# Altium project imx8mnano_som.PrjPcb
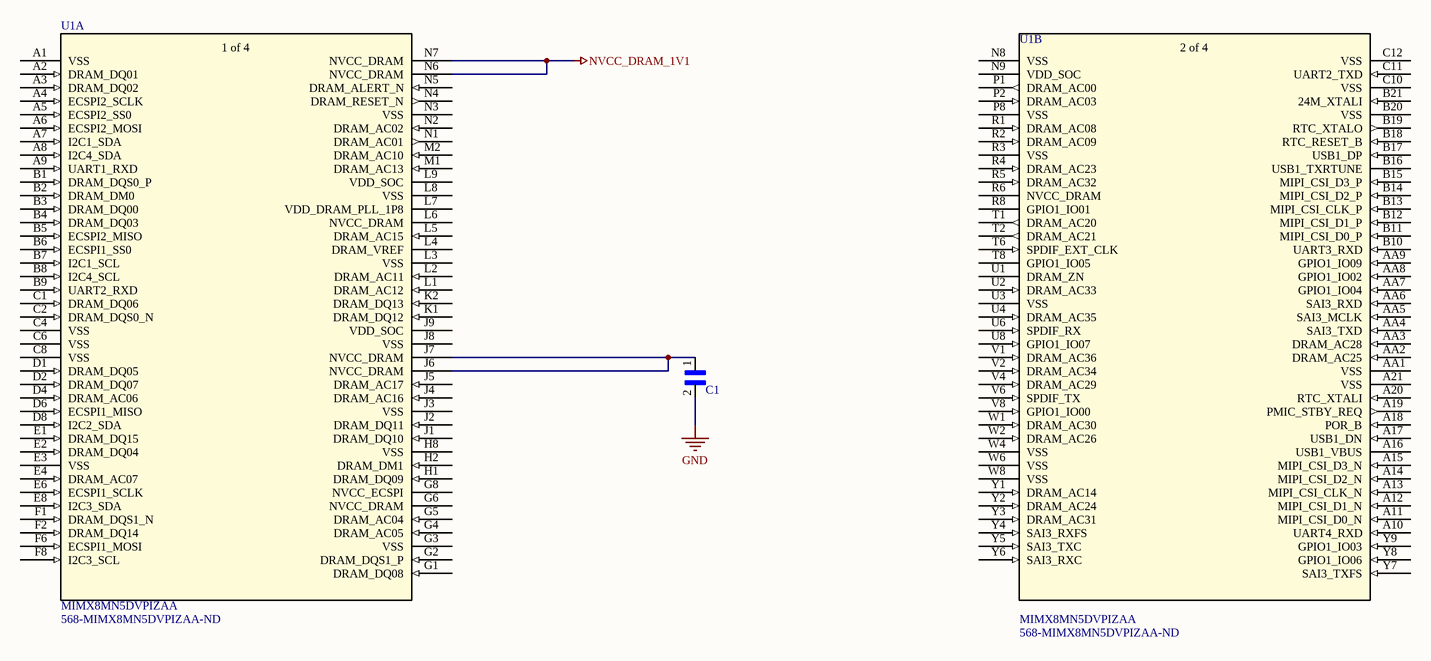
[diagram p0: imx8mnano_power.SchDoc]
7 sheets, 38 parts. Net scope: global (net labels, ports and power ports of the same name join across sheets).
Board file: imx8mnano.PcbDoc
Sheets:
  01_block_digram.SchDoc
  imx8mnano_power.SchDoc
  LPDDR4.SchDoc
  USB.SchDoc
  PMIC.SchDoc
  eMMC_QSPI.SchDoc
  imx8mnano_B.SchDoc

## Sheet 01_block_digram.SchDoc
size A; SheetNumber: 1; SheetTotal: 1

## Sheet imx8mnano_power.SchDoc
size A3; SheetNumber: 2; SheetTotal: 6

### Parts
C1  CL05A106MQ5NUNC  [CL05A106MQ5NUNC]  (value not drawn)
U1  MIMX8MN5DVPIZAA  Supplier Part Number 1: 568-MIMX8MN5DVPIZAA-ND  [MIMX8MN5DVPIZAA_NXP]  (parts A,B of 4)

### Nets
GND: C1.2
NVCC_DRAM_1V1: U1.N6(NVCC_DRAM) U1.N7(NVCC_DRAM)
NetC1_1: C1.1 U1.J6(NVCC_DRAM) U1.J7(NVCC_DRAM)

Not connected (* = marked no-connect by the designer): U1 A1(VSS) A2(DRAM_DQ01) A3(DRAM_DQ02) A4(ECSPI2_SCLK) A5(ECSPI2_SS0) A6(ECSPI2_MOSI) A7(I2C1_SDA) A8(I2C4_SDA) A9(UART1_RXD) A10(UART4_RXD) A11(MIPI_CSI_D0_N) A12(MIPI_CSI_D1_N) A13(MIPI_CSI_CLK_N) A14(MIPI_CSI_D2_N) A15(MIPI_CSI_D3_N) A16(USB1_VBUS) A17(USB1_DN) A18(POR_B) A19(PMIC_STBY_REQ) A20(RTC_XTALI) A21(VSS) AA1(VSS) AA2(DRAM_AC25) AA3(DRAM_AC28) AA4(SAI3_TXD) AA5(SAI3_MCLK) AA6(SAI3_RXD) AA7(GPIO1_IO04) AA8(GPIO1_IO02) AA9(GPIO1_IO09) B1(DRAM_DQS0_P) B2(DRAM_DM0) B3(DRAM_DQ00) B4(DRAM_DQ03) B5(ECSPI2_MISO) B6(ECSPI1_SS0) B7(I2C1_SCL) B8(I2C4_SCL) B9(UART2_RXD) B10(UART3_RXD) B11(MIPI_CSI_D0_P) B12(MIPI_CSI_D1_P) B13(MIPI_CSI_CLK_P) B14(MIPI_CSI_D2_P) B15(MIPI_CSI_D3_P) B16(USB1_TXRTUNE) B17(USB1_DP) B18(RTC_RESET_B) B19(RTC_XTALO) B20(VSS) B21(24M_XTALI) C1(DRAM_DQ06) C2(DRAM_DQS0_N) C4(VSS) C6(VSS) C8(VSS) C10(VSS) C11(UART2_TXD) C12(VSS) D1(DRAM_DQ05) D2(DRAM_DQ07) D4(DRAM_AC06) D6(ECSPI1_MISO) D8(I2C2_SDA) E1(DRAM_DQ15) E2(DRAM_DQ04) E3(VSS) E4(DRAM_AC07) E6(ECSPI1_SCLK) E8(I2C3_SDA) F1(DRAM_DQS1_N) F2(DRAM_DQ14) F6(ECSPI1_MOSI) F8(I2C3_SCL) G1(DRAM_DQ08) G2(DRAM_DQS1_P) G3(VSS) G4(DRAM_AC05) G5(DRAM_AC04) G6(NVCC_DRAM) G8(NVCC_ECSPI) H1(DRAM_DQ09) H2(DRAM_DM1) H8(VSS) J1(DRAM_DQ10) J2(DRAM_DQ11) J3(VSS) J4(DRAM_AC16) J5(DRAM_AC17) J8(VSS) J9(VDD_SOC) K1(DRAM_DQ12) K2(DRAM_DQ13) L1(DRAM_AC12) L2(DRAM_AC11) L3(VSS) L4(DRAM_VREF) L5(DRAM_AC15) L6(NVCC_DRAM) L7(VDD_DRAM_PLL_1P8) L8(VSS) L9(VDD_SOC) M1(DRAM_AC13) M2(DRAM_AC10) N1(DRAM_AC01) N2(DRAM_AC02) N3(VSS) N4(DRAM_RESET_N) N5(DRAM_ALERT_N) N8(VSS) N9(VDD_SOC) P1(DRAM_AC00) P2(DRAM_AC03) P8(VSS) R1(DRAM_AC08) R2(DRAM_AC09) R3(VSS) R4(DRAM_AC23) R5(DRAM_AC32) R6(NVCC_DRAM) R8(GPIO1_IO01) T1(DRAM_AC20) T2(DRAM_AC21) T6(SPDIF_EXT_CLK) T8(GPIO1_IO05) U1(DRAM_ZN) U2(DRAM_AC33) U3(VSS) U4(DRAM_AC35) U6(SPDIF_RX) U8(GPIO1_IO07) V1(DRAM_AC36) V2(DRAM_AC34) V4(DRAM_AC29) V6(SPDIF_TX) V8(GPIO1_IO00) W1(DRAM_AC30) W2(DRAM_AC26) W4(VSS) W6(VSS) W8(VSS) Y1(DRAM_AC14) Y2(DRAM_AC24) Y3(DRAM_AC31) Y4(SAI3_RXFS) Y5(SAI3_TXC) Y6(SAI3_RXC) Y7(SAI3_TXFS) Y8(GPIO1_IO06) Y9(GPIO1_IO03)

### Notes on the sheet
- (in symbol MIMX8MN5DVPIZAA, part A) 1 of 4
- (in symbol MIMX8MN5DVPIZAA, part B) 2 of 4

### Library data of the parts
C1 = CL05A106MQ5NUNC: Multilayer Ceramic Capacitor, 10 uF, 6.3 V, ï¿½ 20%, X5R, 0402 [1005 Metric]; Manufacturer: Samsung; Capacitance: 10uF; Voltage Rating: 6.3V; Supplier 1: Avnet; Manufacturer Part Number: CL05A106MQ5NUNC; RoHS: Yes; Category: Ceramic Capacitors; Stock 1: 540000; Pricing 1: 10000=0.02499, 20000=0.02486, 40000=0.02474, 60000=0.02461, 80000=0.02448 (USD); Mount: Surface Mount; Case/Package: 0402; Case Code (Metric): 1005; Case Code (Imperial): 0402; Min Operating Temperature: -55°C; Max Operating Temperature: 85°C; Packaging: Tape and Reel; Tolerance: 20%; Package Quantity: 1; Dielectric: X5R; Series: CL; Construction: Flat; Length: 1mm; Width: 0.02inch; Height: 0.5mm; Thickness: 0.028inch; Depth: 0.5mm; Radiation Hardening: No; RoHS Compliant: Yes; ComponentLink1URL: https://datasheet.ciiva.com/16437/cl05a106mq5nunc-16437356.pdf?src-supplier=Future+Electronics; ComponentLink1Description: https://datasheet.ciiva.com/16437/cl05a106mq5nunc-16437356.pdf?src-supplier=Future+Electronics; ComponentLink2URL: https://datasheet.ciiva.com/26877/getdatasheetpartid-355289-26877841.pdf?src-supplier=Verical; ComponentLink2Description: https://datasheet.ciiva.com/26877/getdatasheetpartid-355289-26877841.pdf?src-supplier=Verical; Supplier Part Number 1: CL05A106MQ5NUNC
U1 = MIMX8MN5DVPIZAA: I.mx 8M Nano Ultralite, Tray Multiple Dp Bakeable, Tray Rohs Compliant: Yes; Manufacturer: NXP Semiconductors; Supplier 1: Digikey; Manufacturer Part Number: MIMX8MN5DVPIZAA; RoHS: Yes; Category: Microprocessors; Stock 1: 138; Pricing 1: 1=24.94, 10=20.041, 25=18.818, 168=17.09119, 336=16.65952, 504=16.44345 (USD)

## Sheet LPDDR4.SchDoc
size A3; SheetNumber: 3; SheetTotal: 3
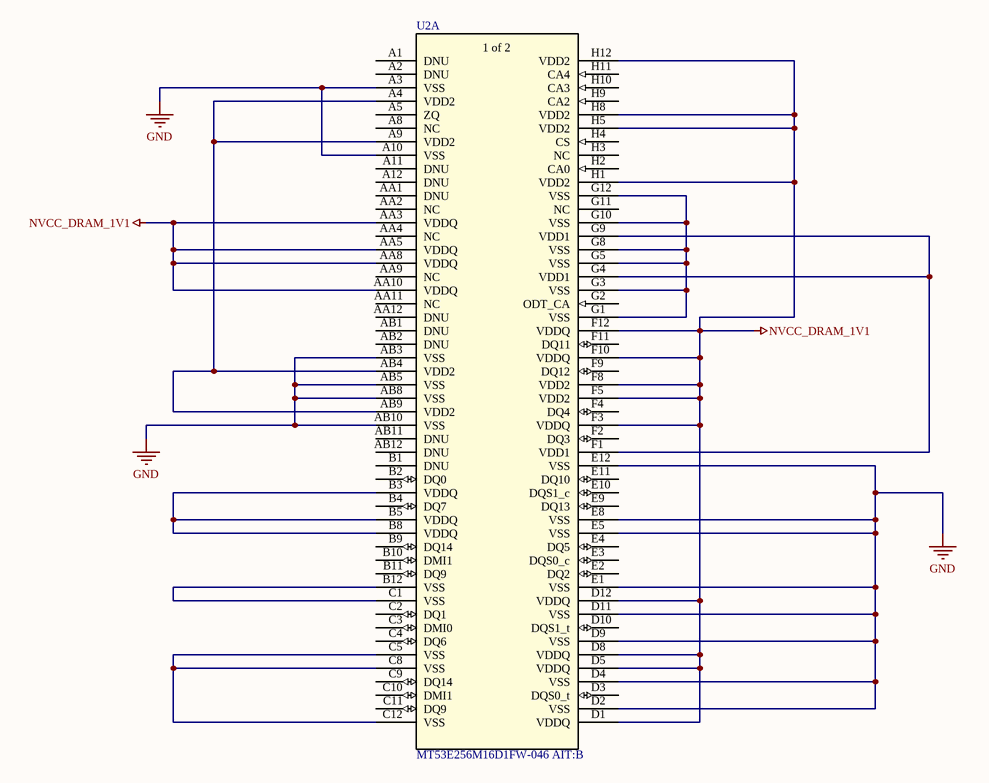
[diagram p1: LPDDR4.SchDoc]

### Parts
U2  MT53E256M16D1FW-046 AIT:B  [TFBGA200_10X14p5X1p1_FW_MRN-M]  (part A of 2)

### Nets
GND: U2.A3(VSS) U2.A10(VSS) U2.AB3(VSS) U2.AB5(VSS) U2.AB8(VSS) U2.AB10(VSS) U2.D2(VSS) U2.D4(VSS) U2.D9(VSS) U2.D11(VSS) U2.E1(VSS) U2.E5(VSS) U2.E8(VSS) U2.E12(VSS)
NVCC_DRAM_1V1: U2.AA3(VDDQ) U2.AA5(VDDQ) U2.AA8(VDDQ) U2.AA10(VDDQ) U2.D1(VDDQ) U2.D5(VDDQ) U2.D8(VDDQ) U2.D12(VDDQ) U2.F3(VDDQ) U2.F5(VDD2) U2.F8(VDD2) U2.F10(VDDQ) U2.F12(VDDQ) U2.H1(VDD2) U2.H5(VDD2) U2.H8(VDD2) U2.H12(VDD2)
NetU2_A4: U2.A4(VDD2) U2.A9(VDD2) U2.AB4(VDD2) U2.AB9(VDD2)
NetU2_B3: U2.B3(VDDQ) U2.B5(VDDQ) U2.B8(VDDQ)
NetU2_B12: U2.B12(VSS) U2.C1(VSS)
NetU2_C5: U2.C5(VSS) U2.C8(VSS) U2.C12(VSS)
NetU2_F1: U2.F1(VDD1) U2.G4(VDD1) U2.G9(VDD1)
NetU2_G1: U2.G1(VSS) U2.G3(VSS) U2.G5(VSS) U2.G8(VSS) U2.G10(VSS) U2.G12(VSS)

Not connected (* = marked no-connect by the designer): U2 A1(DNU) A2(DNU) A5(ZQ) A8(NC) A11(DNU) A12(DNU) AA1(DNU) AA2(NC) AA4(NC) AA9(NC) AA11(NC) AA12(DNU) AB1(DNU) AB2(DNU) AB11(DNU) AB12(DNU) B1(DNU) B2(DQ0) B4(DQ7) B9(DQ14) B10(DMI1) B11(DQ9) C2(DQ1) C3(DMI0) C4(DQ6) C9(DQ14) C10(DMI1) C11(DQ9) D3(DQS0_t) D10(DQS1_t) E2(DQ2) E3(DQS0_c) E4(DQ5) E9(DQ13) E10(DQS1_c) E11(DQ10) F2(DQ3) F4(DQ4) F9(DQ12) F11(DQ11) G2(ODT_CA) G11(NC) H2(CA0) H3(NC) H4(CS) H9(CA2) H10(CA3) H11(CA4)

### Notes on the sheet
- (in symbol MT53E256M16D1FW-046 AIT:B, part A) 1 of 2

### Library data of the parts
U2 = MT53E256M16D1FW-046 AIT:B: No Description Available; Mfr_Name: Micron; Type: Memory; RefDes: RefDes

## Sheet USB.SchDoc
size A; SheetNumber: 4; SheetTotal: 5
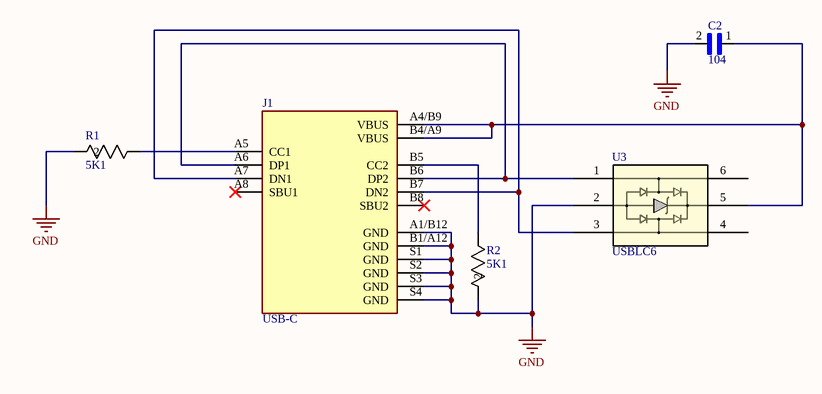
[diagram p2: USB.SchDoc]

### Parts
C2  104  [CAPC1005X55N2]
J1  USB-C  [GCT_USB4110GFA]
R1  5K1  [RC0402]
R2  5K1  [RC0402]
U3  USBLC6  [SOT23-6L_STM]

### Nets
GND: C2.2 J1.A1/B12(GND) J1.B1/A12(GND) J1.S1(GND) J1.S2(GND) J1.S3(GND) J1.S4(GND) R1.2 R2.2 U3.2
NetC2_1: C2.1 J1.A4/B9(VBUS) J1.B4/A9(VBUS) U3.5
NetJ1_A5: J1.A5(CC1) R1.1
NetJ1_A6: J1.A6(DP1) J1.B6(DP2) U3.1
NetJ1_A7: J1.A7(DN1) J1.B7(DN2) U3.3
NetJ1_B5: J1.B5(CC2) R2.1

Not connected (* = marked no-connect by the designer): J1 A8(SBU1)* B8(SBU2)*; U3 4 6

### Library data of the parts
C2 = CC0402KRX7R7BB104: Multilayer Ceramic Capacitor, 0.1 uF, 16 V, ï¿½ 10%, X7R, 0402 [1005 Metric]; Manufacturer: Yageo; Material: 4241ConductorMaterial; Capacitance: 100nF; Voltage Rating: 16V; Temperature Coefficient: 30ppm/°C; Supplier 1: Digikey; Manufacturer Part Number: CC0402KRX7R7BB104; RoHS: Yes; Category: Ceramic Capacitors; Stock 1: 15609894; Pricing 1: 1=0.1, 10=0.024, 50=0.0164, 100=0.0139, 500=0.0098, 1000=0.00852, 2500=0.00718, 5000=0.00636 (USD); Mount: Surface Mount; Case/Package: 0402; Number of Pins: 2; Case Code (Metric): 1005; Case Code (Imperial): 0402; Min Operating Temperature: -55°C; Max Operating Temperature: 125°C; Tolerance: 10%; Voltage Rating (DC): 16V; Packaging: Tape and Reel; Package Quantity: 1; Dielectric: X7R; Termination: SMD/SMT; Voltage: 16V; Series: CC; Voltage Rating (AC): 16V; Length: 1mm; Width: 0.02inch; Height: 0.5mm; Thickness: 0.022inch; Depth: 0.5mm; Radiation Hardening: No; Reach SVHC Compliant: No; RoHS Compliant: Yes; Halogen Free: 5694HalogenFree; Lead Free: 5697LeadFree; ComponentLink1URL: https://datasheet.ciiva.com/11788/0900766b80ce67ed-11788364.pdf?src-supplier=Rs; ComponentLink1Description: https://datasheet.ciiva.com/11788/0900766b80ce67ed-11788364.pdf?src-supplier=Rs; ComponentLink2URL: https://datasheet.ciiva.com/7978/1489800-7978111.pdf?src-supplier=Element14; ComponentLink2Description: https://datasheet.ciiva.com/7978/1489800-7978111.pdf?src-supplier=Element14; ComponentLink3URL: https://datasheet.ciiva.com/161/mlccorderingcode-161545.pdf?src-supplier=Digikey; ComponentLink3Description: https://datasheet.ciiva.com/161/mlccorderingcode-161545.pdf?src-supplier=Digikey; ComponentLink4URL: https://datasheet.ciiva.com/161/mlccorderingcode-161544.pdf?src-supplier=Digikey; ComponentLink4Description: https://datasheet.ciiva.com/161/mlccorderingcode-161544.pdf?src-supplier=Digikey; ComponentLink5URL: https://datasheet.ciiva.com/161/mlccorderingcode-161546.pdf?src-supplier=Digikey; ComponentLink5Description: https://datasheet.ciiva.com/161/mlccorderingcode-161546.pdf?src-supplier=Digikey; ComponentLink6URL: https://datasheet.ciiva.com/8033/1734573-8033661.pdf?src-supplier=Element14; ComponentLink6Description: https://datasheet.ciiva.com/8033/1734573-8033661.pdf?src-supplier=Element14; ComponentLink7URL: https://datasheet.ciiva.com/11587/upy-gphc-x7r-6-3v-to-50v-8-11587305.pdf?src-supplier=Avnet; ComponentLink7Description: https://datasheet.ciiva.com/11587/upy-gphc-x7r-6-3v-to-50v-8-11587305.pdf?src-supplier=Avnet; LCSC: C60474; Supplier Part Number 1: 311-1338-1-ND
J1 = USB4110-GF-A: USB Connector, 16 Contact(s), Male, Right Angle, Surface Mount Terminal, Locking, Receptacle; Manufacturer: Global Connector Technology; USB Standard: 6108USBStandard; Number of Contacts: 16NUMBER; Voltage Rating: 20V; Supplier 1: Digikey; Manufacturer Part Number: USB4110-GF-A; RoHS: No; Category: USB Connectors; Stock 1: 30215; Pricing 1: 1=1.64, 10=1.244, 25=1.1176, 50=1.032, 100=0.9547, 250=0.86368, 500=0.80254 (USD); Number of Pins: 16NUMBER; Contact Material: 153,157ConductorMaterial; Orientation: 5496OrientationType; Height: 3.46mm; ComponentLink1URL: https://gct.co/files/drawings/usb4110.pdf?src-supplier=Digikey; ComponentLink1Description: https://gct.co/files/drawings/usb4110.pdf?src-supplier=Digikey; Supplier Part Number 1: 2073-USB4110-GF-A-1-ND; LCSC: USB4110-GF-A
R1 R2 = RC0402FR-075K1L: SMD Chip Resistor, 5.1 kOhm, ï¿½ 1%, 62.5 mW, 0402 [1005 Metric], Thick Film, General Purpose; Manufacturer: Yageo; Power Rating: 63mW; Voltage Rating: 50V; Resistance: 5.1kR; Temperature Coefficient: 100ppm/°C; Supplier 1: Digikey; Manufacturer Part Number: RC0402FR-075K1L; RoHS: Yes; Category: Chip SMD Resistors; Stock 1: 868211; Pricing 1: 1=0.1, 10=0.009, 50=0.0072, 100=0.0041, 500=0.00306 (USD); Case/Package: 0402; Case Code (Metric): 1005; Case Code (Imperial): 0402; Min Operating Temperature: -55°C; Max Operating Temperature: 155°C; Tolerance: 1%; Packaging: Tape and Reel; Package Quantity: 1; Resistor Type: Thick Film; Number of Terminations: 2; Termination: SMD/SMT; Max Power Dissipation: 63mW; Features: Moisture Resistant; Series: RC; Resistance Tolerance: 1%; Technology: THICK FILM; Voltage Rating (DC): 50V; Working Voltage: 50V; Construction: Rectangular; Length: 1mm; Width: 0.02inch; Height: 0.016inch; Depth: 0.5mm; RoHS Compliant: Yes; Reach SVHC Compliant: Unknown; Lead Free: 5697LeadFree; Military Standard: Not; Supplier Part Number 1: 311-5.10KLRCT-ND; LCSC: C105872
U3 = USBLC6-2SC6: ESD Suppressor Diode Array Dual Uni-Dir 15kV Air Gap/15kV Contact Disc 6-Pin SOT-23 T/R; Manufacturer: STMicroelectronics; Data Rate: 480Mbps; Direction: Unidirectional,Bidirectional; Capacitance: 3.5pF; Operating Supply Voltage: 1.1V; Number of Elements: 1; Number of Channels: 2; Reverse Breakdown Voltage: 6V; Clamping Voltage: 17V; Working Voltage: 5V; Reverse Standoff Voltage: 5.25V; Power Line Protection: Yes; Test Current: 1mA; Max Reverse Leakage Current: 150nA; Peak Pulse Current: 5A; Supplier 1: Digikey; Manufacturer Part Number: USBLC6-2SC6; RoHS: Yes; Category: TVS Diodes; Stock 1: 85420; Pricing 1: 1=0.36, 10=0.243, 100=0.163, 500=0.127, 1000=0.114, 3000=0.09, 6000=0.084, 9000=0.078, 15000=0.077, 21000=0.0755, 30000=0.075 (USD); Mount: Surface Mount; Case/Package: SOT-23; Number of Pins: 6; Min Operating Temperature: -40°C; Max Operating Temperature: 125°C; Packaging: Tape and Reel; Package Quantity: 3000; Polarity: Unidirectional,Bidirectional; Breakdown Voltage: 6V; Termination: SMD/SMT; Number of Bidirectional Channels: 2; Min Breakdown Voltage: 6V; ESD Protection: Yes; Max Breakdown Voltage: 6V; Leakage Current: 150nA; Series: USB; Clamping Voltage-Max: 17V; Max Repetitive Reverse Voltage (Vrrm): 5.25V; Length: 3.05mm; Width: 1.75mm; Height: 1.3mm; Depth: 1.75mm; Radiation Hardening: No; Reach SVHC Compliant: No; Lead Free: Lead Free; RoHS Compliant: Yes; ComponentLink1URL: https://datasheet.ciiva.com/1268/1690354-1268384.pdf?src-supplier=Element14; ComponentLink1Description: https://datasheet.ciiva.com/1268/1690354-1268384.pdf?src-supplier=Element14; ComponentLink2URL: https://datasheet.ciiva.com/4508/cd00050750-113117-4508433.pdf?src-supplier=Mouser; ComponentLink2Description: https://datasheet.ciiva.com/4508/cd00050750-113117-4508433.pdf?src-supplier=Mouser; ComponentLink3URL: https://datasheet.ciiva.com/41444/001184109-da-01-en-ic-esd-protecti-usblc6-2sc6-sot-23-6-stm-41444156.pdf?src-supplier=Conrad; ComponentLink3Description: https://datasheet.ciiva.com/41444/001184109-da-01-en-ic-esd-protecti-usblc6-2sc6-sot-23-6-stm-41444156.pdf?src-supplier=Conrad; Supplier Part Number 1: 497-5235-1-ND; LCSC: C5250994

## Sheet PMIC.SchDoc
size A3; SheetNumber: 5; SheetTotal: 5
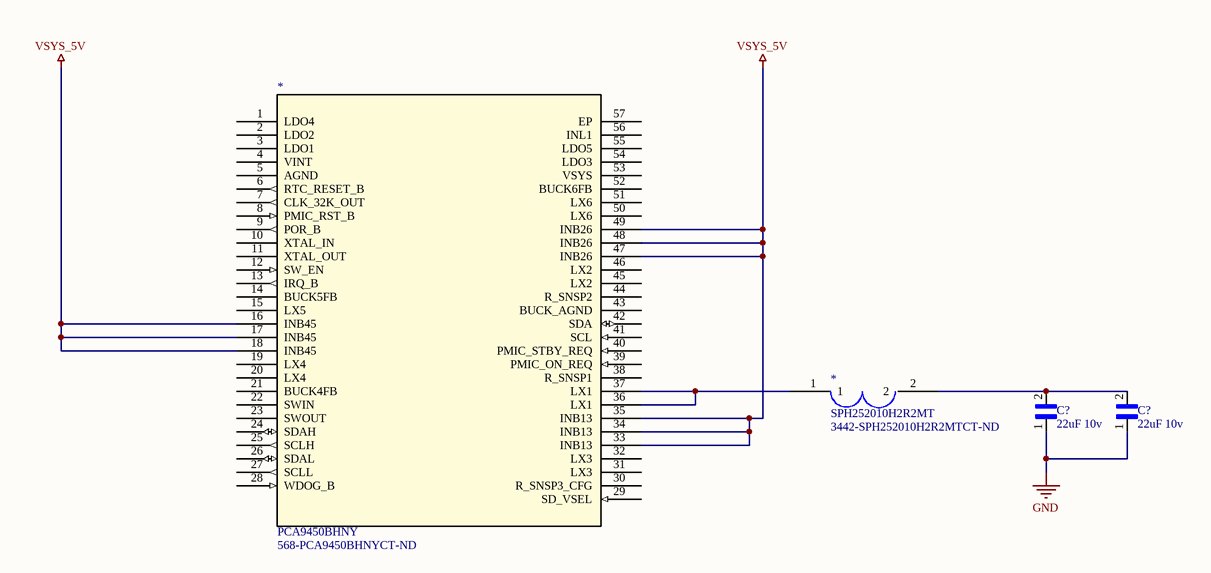
[diagram p3: PMIC.SchDoc]

### Parts
(Parts that share a designator on the sheet are numbered #1, #2 ... from top to bottom, then left to right.)
*#1  PCA9450BHNY  Supplier Part Number 1: 568-PCA9450BHNYCT-ND  [HVQFN56_SOT949-6_NXP]
*#2  SPH252010H2R2MT  Supplier Part Number 1: 3442-SPH252010H2R2MTCT-ND  [IND-SMD_L2.5-W2.0_SWPA252012S]
C?#1  22uF 10v  [CAPC1608X100N]
C?#2  22uF 10v  [CAPC1608X100N]

### Nets
GND: C?#1.1 C?#2.1
VSYS_5V: *#1.16(INB45) *#1.17(INB45) *#1.18(INB45) *#1.33(INB13) *#1.34(INB13) *#1.35(INB13) *#1.47(INB26) *#1.48(INB26) *#1.49(INB26)
Net*#1_36: *#1.36(LX1) *#1.37(LX1) *#2.1
Net*#2_2: *#2.2 C?#1.2 C?#2.2

Not connected (* = marked no-connect by the designer): *#1 1(LDO4) 2(LDO2) 3(LDO1) 4(VINT) 5(AGND) 6(RTC_RESET_B) 7(CLK_32K_OUT) 8(PMIC_RST_B) 9(POR_B) 10(XTAL_IN) 11(XTAL_OUT) 12(SW_EN) 13(IRQ_B) 14(BUCK5FB) 15(LX5) 19(LX4) 20(LX4) 21(BUCK4FB) 22(SWIN) 23(SWOUT) 24(SDAH) 25(SCLH) 26(SDAL) 27(SCLL) 28(WDOG_B) 29(SD_VSEL) 30(R_SNSP3_CFG) 31(LX3) 32(LX3) 38(R_SNSP1) 39(PMIC_ON_REQ) 40(PMIC_STBY_REQ) 41(SCL) 42(SDA) 43(BUCK_AGND) 44(R_SNSP2) 45(LX2) 46(LX2) 50(LX6) 51(LX6) 52(BUCK6FB) 53(VSYS) 54(LDO3) 55(LDO5) 56(INL1) 57(EP)

### Library data of the parts
*#1 = PCA9450BHNY: Power Manage Ic (Pmic) For I.mx 8M Nano Rohs Compliant: Yes |Nxp PCA9450BHNY; Manufacturer: NXP Semiconductors; Supplier 1: Digikey; Manufacturer Part Number: PCA9450BHNY; RoHS: No; Category: Power Management ICs; Stock 1: 7995; Pricing 1: 1=5.66, 10=4.331, 25=3.9992, 100=3.6339, 250=3.45972, 500=3.35474, 1000=3.26833 (USD); RoHS Compliant: Yes; ComponentLink1URL: https://datasheet.octopart.com/PCA9450BHNY-NXP-Semiconductors-datasheet-150009921.pdf?src-supplier=Future+Electronics; ComponentLink1Description: https://datasheet.octopart.com/PCA9450BHNY-NXP-Semiconductors-datasheet-150009921.pdf?src-supplier=Future+Electronics
*#2 = SPH252010H2R2MT: Fixed Ind 2.220%UH 0.114 Ohm 1800; Manufacturer: Sunlord; Supplier 1: Digikey; Manufacturer Part Number: SPH252010H2R2MT; RoHS: Yes; Category: Fixed Inductors; Stock 1: 1953; Pricing 1: 1=0.27, 10=0.207, 25=0.1872, 50=0.1736, 100=0.1609, 250=0.14548, 500=0.13478, 1000=0.125 (USD); RoHS Compliant: Yes
C?#1 C?#2 = GRM188R61A226ME15D: SMD Capacitor X5R(EIA) with Capacitance: 22uF Tol. 20%. Rated Voltage: 10Vdc; Value: *; Availability: Unavailable; Package: None; MP: GRM188R61A226ME15D; Price: None

## Sheet eMMC_QSPI.SchDoc
size 386 x 246 mm; SheetNumber: 6; SheetTotal: 7
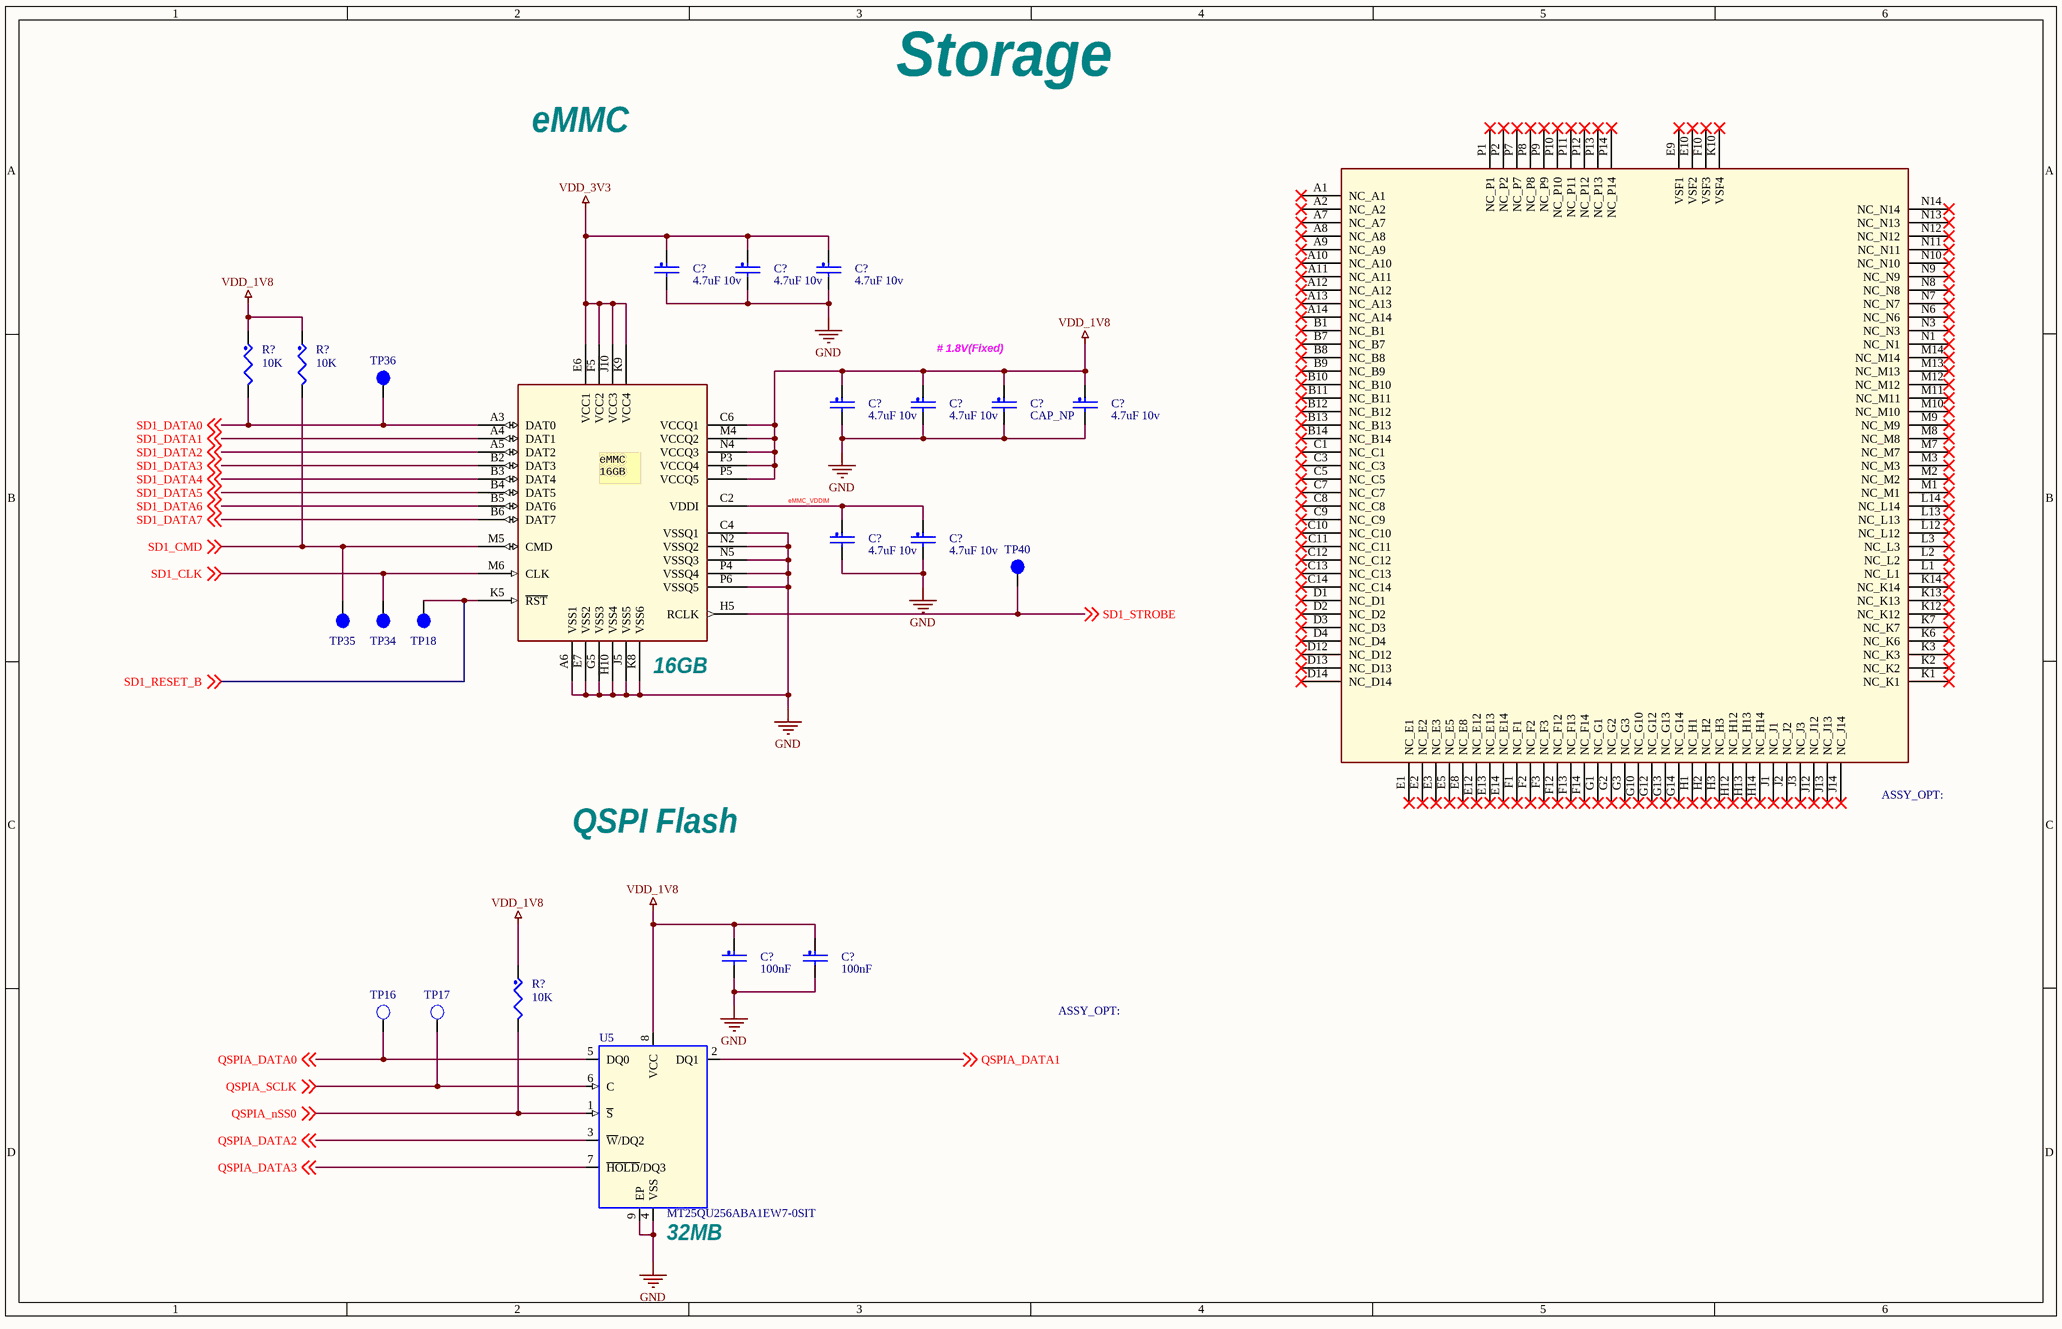
[diagram p4: eMMC_QSPI.SchDoc]

### Parts
(Parts that share a designator on the sheet are numbered #1, #2 ... from top to bottom, then left to right.)
C?#3  4.7uF 10v  [RC0402]
C?#4  4.7uF 10v  [RC0402]
C?#5  4.7uF 10v  [RC0402]
C?#6  4.7uF 10v  [RC0402]
C?#7  4.7uF 10v  [RC0402]
C?#8  CAP_NP  [RC0402]
C?#9  4.7uF 10v  [RC0402]
C?#10  4.7uF 10v  [RC0402]
C?#11  4.7uF 10v  [RC0402]
C?#12  100nF  [RC0402]
C?#13  100nF  [RC0402]
R?#1  10K  [RC0402X]
R?#2  10K  [RC0402X]
R?#3  10K  [RC0402X]
TP16  TP_35MIL  [testpoint_35mil]  (value not drawn)
TP17  TP_35MIL  [testpoint_35mil]  (value not drawn)
TP18  tpad_020  [tpad_020]  (value not drawn)
TP34  tpad_020  [tpad_020]  (value not drawn)
TP35  TPAD_015  [TPAD_015]  (value not drawn)
TP36  tpad_020  [tpad_020]  (value not drawn)
TP40  TPAD_015  [TPAD_015]  (value not drawn)
U5  MT25QU256ABA1EW7-0SIT  [dfn8_1p27_6x5mm_3p1]
U?#1  SDINBDG4-16G_VFBGA_153P  [BGA153N50P14X14_1300X1150X80]  (value not drawn)  (part B of 2)
U?#2  SDINBDG4-16G_VFBGA_153P  [BGA153N50P14X14_1300X1150X80]  (value not drawn)  (part A of 2)

### Nets
GND: C?#3.2 C?#4.2 C?#5.2 C?#6.2 C?#7.2 C?#8.2 C?#9.2 C?#10.2 C?#11.2 C?#12.2 C?#13.2 U5.4(VSS) U5.9(EP) U?#2.A6(VSS1) U?#2.C4(VSSQ1) U?#2.E7(VSS2) U?#2.G5(VSS3) U?#2.H10(VSS4) U?#2.J5(VSS5) U?#2.K8(VSS6) U?#2.N2(VSSQ2) U?#2.N5(VSSQ3) U?#2.P4(VSSQ4) U?#2.P6(VSSQ5)
VDD_1V8: C?#6.1 C?#7.1 C?#8.1 C?#9.1 C?#12.1 C?#13.1 R?#1.1 R?#2.1 R?#3.1 U5.8(VCC) U?#2.C6(VCCQ1) U?#2.M4(VCCQ2) U?#2.N4(VCCQ3) U?#2.P3(VCCQ4) U?#2.P5(VCCQ5)
VDD_3V3: C?#3.1 C?#4.1 C?#5.1 U?#2.E6(VCC1) U?#2.F5(VCC2) U?#2.J10(VCC3) U?#2.K9(VCC4)
eMMC_VDDIM: C?#10.1 C?#11.1 U?#2.C2(VDDI)
QSPIA_DATA0: TP16.1(TP) U5.5(DQ0) ; off-sheet QSPIA_DATA0
QSPIA_DATA1: U5.2(DQ1) ; off-sheet QSPIA_DATA1
QSPIA_DATA2: U5.3(~{W}/DQ2) ; off-sheet QSPIA_DATA2
QSPIA_DATA3: U5.7(~{HOLD}/DQ3) ; off-sheet QSPIA_DATA3
QSPIA_nSS0: R?#3.2 U5.1(~{S}) ; off-sheet QSPIA_nSS0
QSPIA_SCLK: TP17.1(TP) U5.6(C) ; off-sheet QSPIA_SCLK
SD1_CLK: TP34.1(Pin1) U?#2.M6(CLK) ; off-sheet SD1_CLK
SD1_CMD: R?#2.2 TP35.1(Pin1) U?#2.M5(CMD) ; off-sheet SD1_CMD
SD1_DATA0: R?#1.2 TP36.1(Pin1) U?#2.A3(DAT0) ; off-sheet SD1_DATA0
SD1_DATA1: U?#2.A4(DAT1) ; off-sheet SD1_DATA1
SD1_DATA2: U?#2.A5(DAT2) ; off-sheet SD1_DATA2
SD1_DATA3: U?#2.B2(DAT3) ; off-sheet SD1_DATA3
SD1_DATA4: U?#2.B3(DAT4) ; off-sheet SD1_DATA4
SD1_DATA5: U?#2.B4(DAT5) ; off-sheet SD1_DATA5
SD1_DATA6: U?#2.B5(DAT6) ; off-sheet SD1_DATA6
SD1_DATA7: U?#2.B6(DAT7) ; off-sheet SD1_DATA7
SD1_RESET_B: TP18.1(Pin1) U?#2.K5(~{RST}) ; off-sheet SD1_RESET_B
SD1_STROBE: TP40.1(Pin1) U?#2.H5(RCLK) ; off-sheet SD1_STROBE

Not connected (* = marked no-connect by the designer): U?#1 A1(NC_A1)* A2(NC_A2)* A7(NC_A7)* A8(NC_A8)* A9(NC_A9)* A10(NC_A10)* A11(NC_A11)* A12(NC_A12)* A13(NC_A13)* A14(NC_A14)* B1(NC_B1)* B7(NC_B7)* B8(NC_B8)* B9(NC_B9)* B10(NC_B10)* B11(NC_B11)* B12(NC_B12)* B13(NC_B13)* B14(NC_B14)* C1(NC_C1)* C3(NC_C3)* C5(NC_C5)* C7(NC_C7)* C8(NC_C8)* C9(NC_C9)* C10(NC_C10)* C11(NC_C11)* C12(NC_C12)* C13(NC_C13)* C14(NC_C14)* D1(NC_D1)* D2(NC_D2)* D3(NC_D3)* D4(NC_D4)* D12(NC_D12)* D13(NC_D13)* D14(NC_D14)* E1(NC_E1)* E2(NC_E2)* E3(NC_E3)* E5(NC_E5)* E8(NC_E8)* E9(VSF1)* E10(VSF2)* E12(NC_E12)* E13(NC_E13)* E14(NC_E14)* F1(NC_F1)* F2(NC_F2)* F3(NC_F3)* F10(VSF3)* F12(NC_F12)* F13(NC_F13)* F14(NC_F14)* G1(NC_G1)* G2(NC_G2)* G3(NC_G3)* G10(NC_G10)* G12(NC_G12)* G13(NC_G13)* G14(NC_G14)* H1(NC_H1)* H2(NC_H2)* H3(NC_H3)* H12(NC_H12)* H13(NC_H13)* H14(NC_H14)* J1(NC_J1)* J2(NC_J2)* J3(NC_J3)* J12(NC_J12)* J13(NC_J13)* J14(NC_J14)* K1(NC_K1)* K2(NC_K2)* K3(NC_K3)* K6(NC_K6)* K7(NC_K7)* K10(VSF4)* K12(NC_K12)* K13(NC_K13)* K14(NC_K14)* L1(NC_L1)* L2(NC_L2)* L3(NC_L3)* L12(NC_L12)* L13(NC_L13)* L14(NC_L14)* M1(NC_M1)* M2(NC_M2)* M3(NC_M3)* M7(NC_M7)* M8(NC_M8)* M9(NC_M9)* M10(NC_M10)* M11(NC_M11)* M12(NC_M12)* M13(NC_M13)* M14(NC_M14)* N1(NC_N1)* N3(NC_N3)* N6(NC_N6)* N7(NC_N7)* N8(NC_N8)* N9(NC_N9)* N10(NC_N10)* N11(NC_N11)* N12(NC_N12)* N13(NC_N13)* N14(NC_N14)* P1(NC_P1)* P2(NC_P2)* P7(NC_P7)* P8(NC_P8)* P9(NC_P9)* P10(NC_P10)* P11(NC_P11)* P12(NC_P12)* P13(NC_P13)* P14(NC_P14)*

### Notes on the sheet
- Storage
- eMMC
- (near C?#8) # 1.8V(Fixed)
- (near U?#2) 16GB
- QSPI Flash
- (near U5) 32MB
- (in symbol SDINBDG4-16G_VFBGA_153P, part A) eMMC / 16GB

### Library data of the parts
C?#3-C?#13 = CAP_NP: CLASS: DISCRETE
R?#1-R?#3 = RES: CLASS: DISCRETE
TP16 TP17 = T POINT R: TEST POINT PAD .035 SMT, no part to order; ASSY_OPT: DNP; CLASS: IC; CAD_APPROVED: Yes; AGILE_PN: 510-75618; HEIGHT: 0.1MM; ROHS: Yes; PCB Footprint: testpoint_35mil
TP18 TP36 = TESTLOOP: TEST POINT PAD 0.5MM DIA SMT, NO PART TO ORDER; CLASS: IO; ASSY_OPT: DNP; AGILE_PN: 211-77484; CAD_APPROVED: Yes; ROHS: Yes; HEIGHT: 0.1MM; PCB Footprint: tpad_020
TP34 = TESTLOOP: TEST POINT PAD 0.5MM DIA SMT, NO PART TO ORDER; CLASS: IO; ASSY_OPT: DNP; CAD_APPROVED: Yes; AGILE_PN: 211-77484; HEIGHT: 0.1MM; ROHS: Yes; PCB Footprint: tpad_020
TP35 = TESTLOOP: TEST POINT PAD 15MIL DIA SMT, NO PART TO ORDER; CLASS: IO; ASSY_OPT: DNP; AGILE_PN: 211-76645; MFG_NAME01: NOTACOMPONENT; CAD_APPROVED: Yes; MFG_PN01: NOTACOMPONENT; ROHS: Yes; HEIGHT: 0.1MM; PCB Footprint: TPAD_015
TP40 = TESTLOOP: TEST POINT PAD 15MIL DIA SMT, NO PART TO ORDER; CLASS: IO; AGILE_PN: 211-76645; MFG_NAME01: NOTACOMPONENT; CAD_APPROVED: Yes; MFG_PN01: NOTACOMPONENT; ROHS: Yes; HEIGHT: 0.1MM; PCB Footprint: TPAD_015
U5 = MT25QL256ABA1EW9_9P: IC MEM FLASH SERIAL NOR 256MBIT 166MHZ 1.7-2V WPDFN8; AGILE_PN: 334-77688; MFG_NAME01: MICRON; CAD_APPROVED: Yes; CLASS: IC; PCB Footprint: dfn8_1p27_6x5mm_3p1; MFG_PN01: MT25QU256ABA1EW7-0SIT; ROHS: Yes; HEIGHT: 0.8 MM; VOLTAGE: 1.7-2V
U?#1 U?#2 = SDINBDG4-16G_VFBGA_153P: CLASS: IC

## Sheet imx8mnano_B.SchDoc
size A3; SheetNumber: 7; SheetTotal: 7
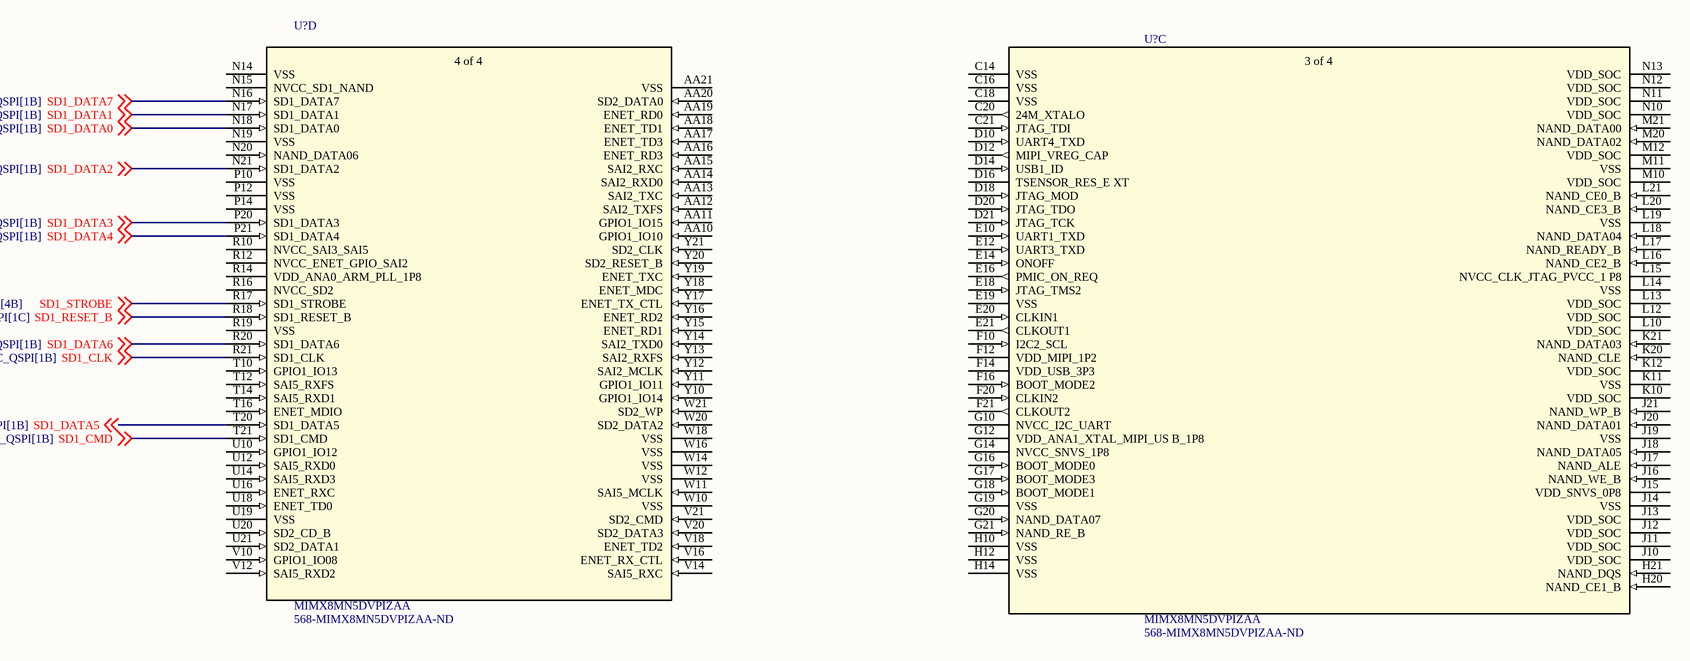
[diagram p5: imx8mnano_B.SchDoc]

### Parts
(Parts that share a designator on the sheet are numbered #1, #2 ... from top to bottom, then left to right.)
U?#3  MIMX8MN5DVPIZAA  Supplier Part Number 1: 568-MIMX8MN5DVPIZAA-ND  [MIMX8MN5DVPIZAA_NXP]  (part D of 4)
U?#4  MIMX8MN5DVPIZAA  Supplier Part Number 1: 568-MIMX8MN5DVPIZAA-ND  [MIMX8MN5DVPIZAA_NXP]  (part C of 4)

### Nets
SD1_CLK: U?#3.R21(SD1_CLK) ; off-sheet SD1_CLK
SD1_CMD: U?#3.T21(SD1_CMD) ; off-sheet SD1_CMD
SD1_DATA0: U?#3.N18(SD1_DATA0) ; off-sheet SD1_DATA0
SD1_DATA1: U?#3.N17(SD1_DATA1) ; off-sheet SD1_DATA1
SD1_DATA2: U?#3.N21(SD1_DATA2) ; off-sheet SD1_DATA2
SD1_DATA3: U?#3.P20(SD1_DATA3) ; off-sheet SD1_DATA3
SD1_DATA4: U?#3.P21(SD1_DATA4) ; off-sheet SD1_DATA4
SD1_DATA5: U?#3.T20(SD1_DATA5) ; off-sheet SD1_DATA5
SD1_DATA6: U?#3.R20(SD1_DATA6) ; off-sheet SD1_DATA6
SD1_DATA7: U?#3.N16(SD1_DATA7) ; off-sheet SD1_DATA7
SD1_RESET_B: U?#3.R18(SD1_RESET_B) ; off-sheet SD1_RESET_B
SD1_STROBE: U?#3.R17(SD1_STROBE) ; off-sheet SD1_STROBE

Not connected (* = marked no-connect by the designer): U?#3 AA10(GPIO1_IO10) AA11(GPIO1_IO15) AA12(SAI2_TXFS) AA13(SAI2_TXC) AA14(SAI2_RXD0) AA15(SAI2_RXC) AA16(ENET_RD3) AA17(ENET_TD3) AA18(ENET_TD1) AA19(ENET_RD0) AA20(SD2_DATA0) AA21(VSS) N14(VSS) N15(NVCC_SD1_NAND) N19(VSS) N20(NAND_DATA06) P10(VSS) P12(VSS) P14(VSS) R10(NVCC_SAI3_SAI5) R12(NVCC_ENET_GPIO_SAI2) R14(VDD_ANA0_ARM_PLL_1P8) R16(NVCC_SD2) R19(VSS) T10(GPIO1_IO13) T12(SAI5_RXFS) T14(SAI5_RXD1) T16(ENET_MDIO) U10(GPIO1_IO12) U12(SAI5_RXD0) U14(SAI5_RXD3) U16(ENET_RXC) U18(ENET_TD0) U19(VSS) U20(SD2_CD_B) U21(SD2_DATA1) V10(GPIO1_IO08) V12(SAI5_RXD2) V14(SAI5_RXC) V16(ENET_RX_CTL) V18(ENET_TD2) V20(SD2_DATA3) V21(SD2_CMD) W10(VSS) W11(SAI5_MCLK) W12(VSS) W14(VSS) W16(VSS) W18(VSS) W20(SD2_DATA2) W21(SD2_WP) Y10(GPIO1_IO14) Y11(GPIO1_IO11) Y12(SAI2_MCLK) Y13(SAI2_RXFS) Y14(SAI2_TXD0) Y15(ENET_RD1) Y16(ENET_RD2) Y17(ENET_TX_CTL) Y18(ENET_MDC) Y19(ENET_TXC) Y20(SD2_RESET_B) Y21(SD2_CLK); U?#4 C14(VSS) C16(VSS) C18(VSS) C20(24M_XTALO) C21(JTAG_TDI) D10(UART4_TXD) D12(MIPI_VREG_CAP) D14(USB1_ID) D16(TSENSOR_RES_E_XT) D18(JTAG_MOD) D20(JTAG_TDO) D21(JTAG_TCK) E10(UART1_TXD) E12(UART3_TXD) E14(ONOFF) E16(PMIC_ON_REQ) E18(JTAG_TMS2) E19(VSS) E20(CLKIN1) E21(CLKOUT1) F10(I2C2_SCL) F12(VDD_MIPI_1P2) F14(VDD_USB_3P3) F16(BOOT_MODE2) F20(CLKIN2) F21(CLKOUT2) G10(NVCC_I2C_UART) G12(VDD_ANA1_XTAL_MIPI_US_B_1P8) G14(NVCC_SNVS_1P8) G16(BOOT_MODE0) G17(BOOT_MODE3) G18(BOOT_MODE1) G19(VSS) G20(NAND_DATA07) G21(NAND_RE_B) H10(VSS) H12(VSS) H14(VSS) H20(NAND_CE1_B) H21(NAND_DQS) J10(VDD_SOC) J11(VDD_SOC) J12(VDD_SOC) J13(VDD_SOC) J14(VSS) J15(VDD_SNVS_0P8) J16(NAND_WE_B) J17(NAND_ALE) J18(NAND_DATA05) J19(VSS) J20(NAND_DATA01) J21(NAND_WP_B) K10(VDD_SOC) K11(VSS) K12(VDD_SOC) K20(NAND_CLE) K21(NAND_DATA03) L10(VDD_SOC) L12(VDD_SOC) L13(VDD_SOC) L14(VSS) L15(NVCC_CLK_JTAG_PVCC_1_P8) L16(NAND_CE2_B) L17(NAND_READY_B) L18(NAND_DATA04) L19(VSS) L20(NAND_CE3_B) L21(NAND_CE0_B) M10(VDD_SOC) M11(VSS) M12(VDD_SOC) M20(NAND_DATA02) M21(NAND_DATA00) N10(VDD_SOC) N11(VDD_SOC) N12(VDD_SOC) N13(VDD_SOC)

### Notes on the sheet
- (in symbol MIMX8MN5DVPIZAA, part C) 3 of 4
- (in symbol MIMX8MN5DVPIZAA, part D) 4 of 4

### Library data of the parts
U?#3 U?#4 = MIMX8MN5DVPIZAA: as U1 on sheet imx8mnano_power; Supplier 1: Digikey; Manufacturer Part Number: MIMX8MN5DVPIZAA; RoHS: Yes; Category: Microprocessors; Stock 1: 138; Pricing 1: 1=24.94, 10=20.041, 25=18.818, 168=17.09119, 336=16.65952, 504=16.44345 (USD)

## Nets that join several sheets
GND: imx8mnano_power (C1.2), LPDDR4 (14 pins), USB (10 pins), PMIC (C?#1.1 C?#2.1), eMMC_QSPI (24 pins)
NVCC_DRAM_1V1: imx8mnano_power (U1.N6 U1.N7), LPDDR4 (17 pins)
SD1_CLK: eMMC_QSPI (TP34.1 U?#2.M6), imx8mnano_B (U?#3.R21)
SD1_CMD: eMMC_QSPI (R?#2.2 TP35.1 U?#2.M5), imx8mnano_B (U?#3.T21)
SD1_DATA0: eMMC_QSPI (R?#1.2 TP36.1 U?#2.A3), imx8mnano_B (U?#3.N18)
SD1_DATA1: eMMC_QSPI (U?#2.A4), imx8mnano_B (U?#3.N17)
SD1_DATA2: eMMC_QSPI (U?#2.A5), imx8mnano_B (U?#3.N21)
SD1_DATA3: eMMC_QSPI (U?#2.B2), imx8mnano_B (U?#3.P20)
SD1_DATA4: eMMC_QSPI (U?#2.B3), imx8mnano_B (U?#3.P21)
SD1_DATA5: eMMC_QSPI (U?#2.B4), imx8mnano_B (U?#3.T20)
SD1_DATA6: eMMC_QSPI (U?#2.B5), imx8mnano_B (U?#3.R20)
SD1_DATA7: eMMC_QSPI (U?#2.B6), imx8mnano_B (U?#3.N16)
SD1_RESET_B: eMMC_QSPI (TP18.1 U?#2.K5), imx8mnano_B (U?#3.R18)
SD1_STROBE: eMMC_QSPI (TP40.1 U?#2.H5), imx8mnano_B (U?#3.R17)